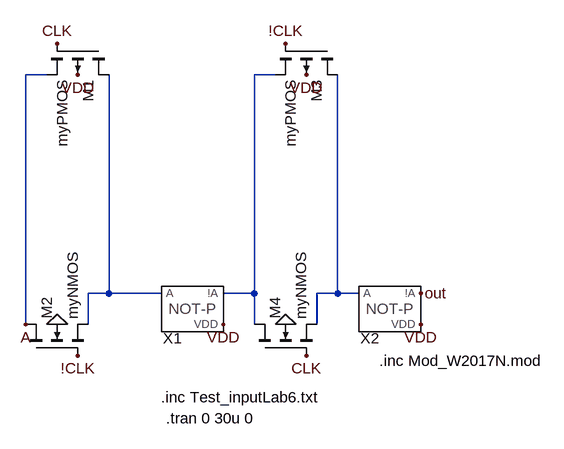
[diagram p0: schematic Lab_6_DFF.asc]
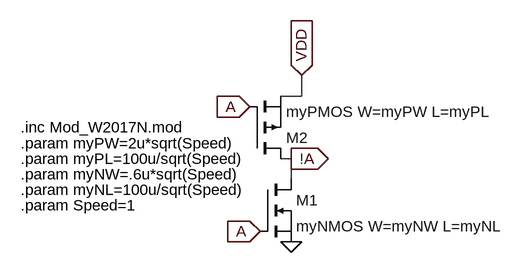
[diagram p1: sub-circuit gate_not_param.asc]
Lab_6_DFF.asc, the LTspice schematic file:
Version 4
SHEET 1 880 680
WIRE -192 -192 -224 -192
WIRE 160 -192 128 -192
WIRE -96 144 -96 -192
WIRE -96 144 -128 144
WIRE -16 144 -96 144
WIRE 128 144 128 -192
WIRE 128 144 80 144
WIRE 256 144 256 -192
WIRE 256 144 224 144
WIRE 288 144 256 144
WIRE -224 192 -224 -192
WIRE -128 192 -128 144
WIRE 128 192 128 144
WIRE 224 192 224 144
FLAG -144 240 !CLK
FLAG 176 -240 !CLK
FLAG -176 -240 CLK
FLAG 208 240 CLK
FLAG 80 192 VDD
FLAG 384 192 VDD
FLAG -224 192 A
FLAG 384 144 out
FLAG 176 192 0
FLAG -176 192 0
FLAG 208 -192 VDD
FLAG -144 -192 VDD
SYMBOL Gate_NOT_PARAM 32 176 R0
SYMATTR InstName X1
SYMBOL Gate_NOT_PARAM 336 176 R0
SYMATTR InstName X2
SYMBOL nmos4 128 240 R270
SYMATTR InstName M4
SYMATTR Value myNMOS
SYMBOL nmos4 -224 240 R270
SYMATTR InstName M2
SYMATTR Value myNMOS
SYMBOL pmos4 256 -240 R90
SYMATTR InstName M3
SYMATTR Value myPMOS
SYMBOL pmos4 -96 -240 R90
SYMATTR InstName M1
SYMATTR Value myPMOS
TEXT -16 304 Left 2 !.inc Test_inputLab6.txt
TEXT -8 336 Left 2 !.tran 0 30u 0
TEXT 320 248 Left 2 !.inc Mod_W2017N.mod

gate_not_param.asc, the sub-circuit schematic file:
Version 4
SHEET 1 880 680
WIRE 64 -112 64 -144
WIRE 64 -112 32 -112
WIRE 48 -16 32 -16
WIRE 48 16 48 -16
FLAG 48 -16 !A
IOPIN 48 -16 Out
FLAG 64 -144 VDD
IOPIN 64 -144 In
FLAG 48 112 0
FLAG 0 96 A
IOPIN 0 96 In
FLAG -16 -96 A
IOPIN -16 -96 In
SYMBOL nmos 0 16 R0
SYMATTR InstName M1
SYMATTR Value myNMOS W=myNW L=myNL
SYMBOL pmos -16 -16 M180
SYMATTR InstName M2
SYMATTR Value myPMOS W=myPW L=myPL
TEXT -368 -64 Left 2 !.inc Mod_W2017N.mod
TEXT -368 -40 Left 2 !.param myPW=2u*sqrt(Speed)
TEXT -368 -16 Left 2 !.param myPL=100u/sqrt(Speed)
TEXT -368 8 Left 2 !.param myNW=.6u*sqrt(Speed)
TEXT -368 32 Left 2 !.param myNL=100u/sqrt(Speed)
TEXT -368 56 Left 2 !.param Speed=1

The netlist it stands for:
* Lab_6_DFF.asc
XX1 N002 VDD N001 gate_not_param
XX2 N003 VDD out gate_not_param
M4 N001 CLK N003 0 myNMOS
M2 A !CLK N002 0 myNMOS
M3 N003 !CLK N001 VDD myPMOS
M1 N002 CLK A VDD myPMOS

* block symbol definitions
.subckt gate_not_param A VDD !A
M1 !A A 0 0 myNMOS W=myNW L=myNL
M2 !A A VDD VDD myPMOS W=myPW L=myPL
.inc Mod_W2017N.mod
.param myPW=2u*sqrt(Speed)
.param myPL=100u/sqrt(Speed)
.param myNW=.6u*sqrt(Speed)
.param myNL=100u/sqrt(Speed)
.param Speed=1
.ends gate_not_param

.model NMOS NMOS
.model PMOS PMOS
.lib standard.mos
.inc Test_inputLab6.txt
.tran 0 30u 0
.inc Mod_W2017N.mod
.backanno
.end